# EAGLE schematic ECUTeen3.5_rev.A_20180306 (EAGLE 7.5.0)
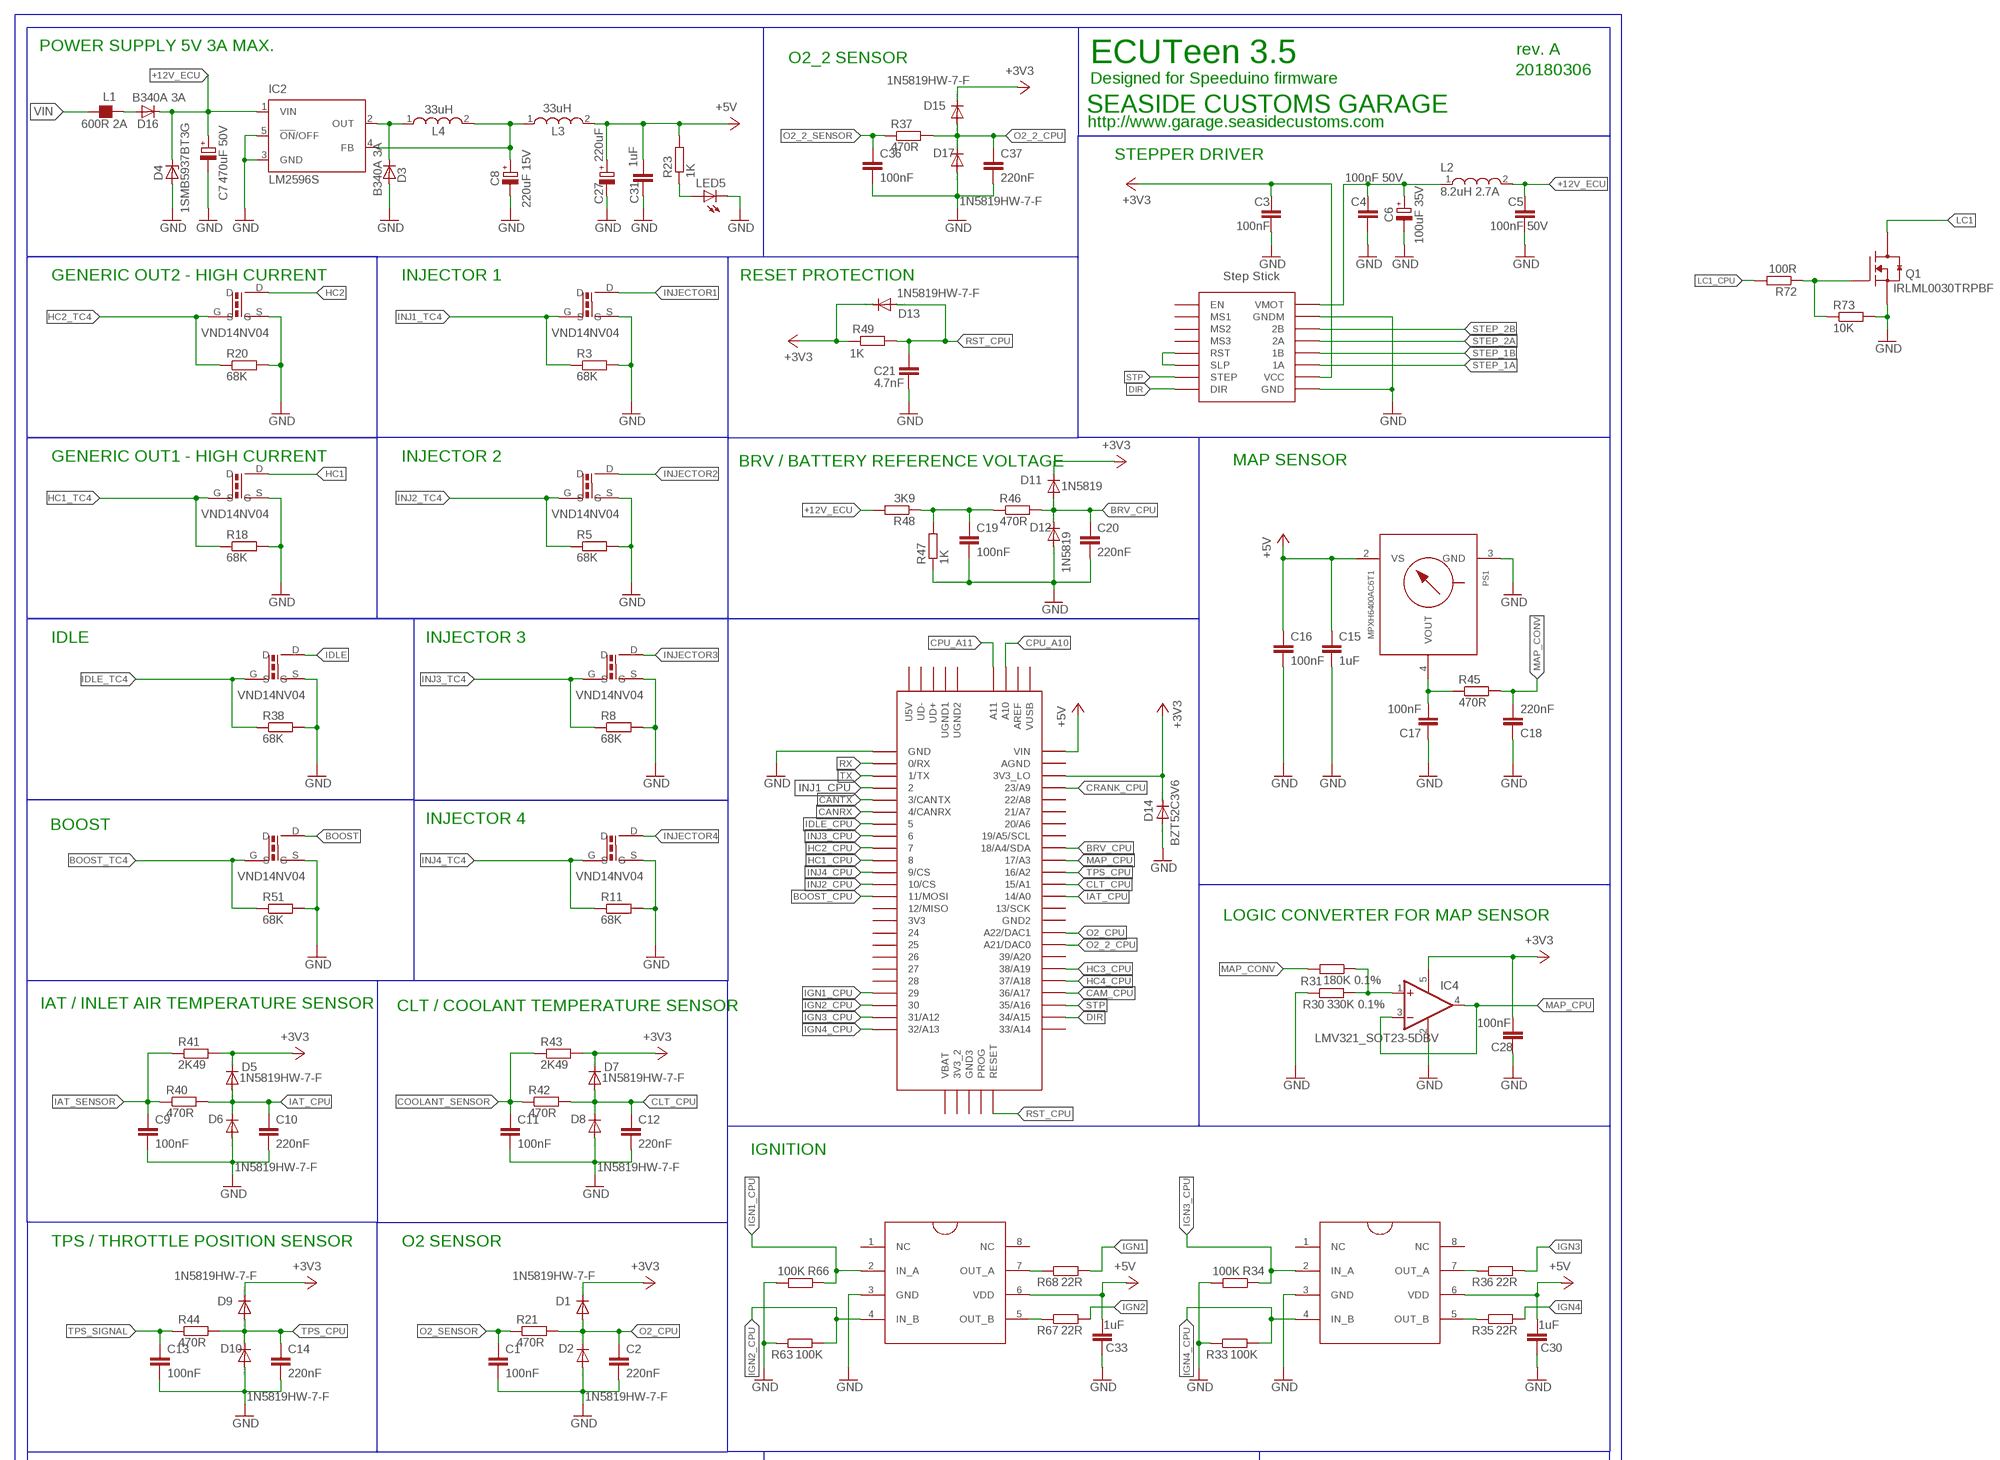
[diagram p0: schematic, sheet 1, part 1 of 2]
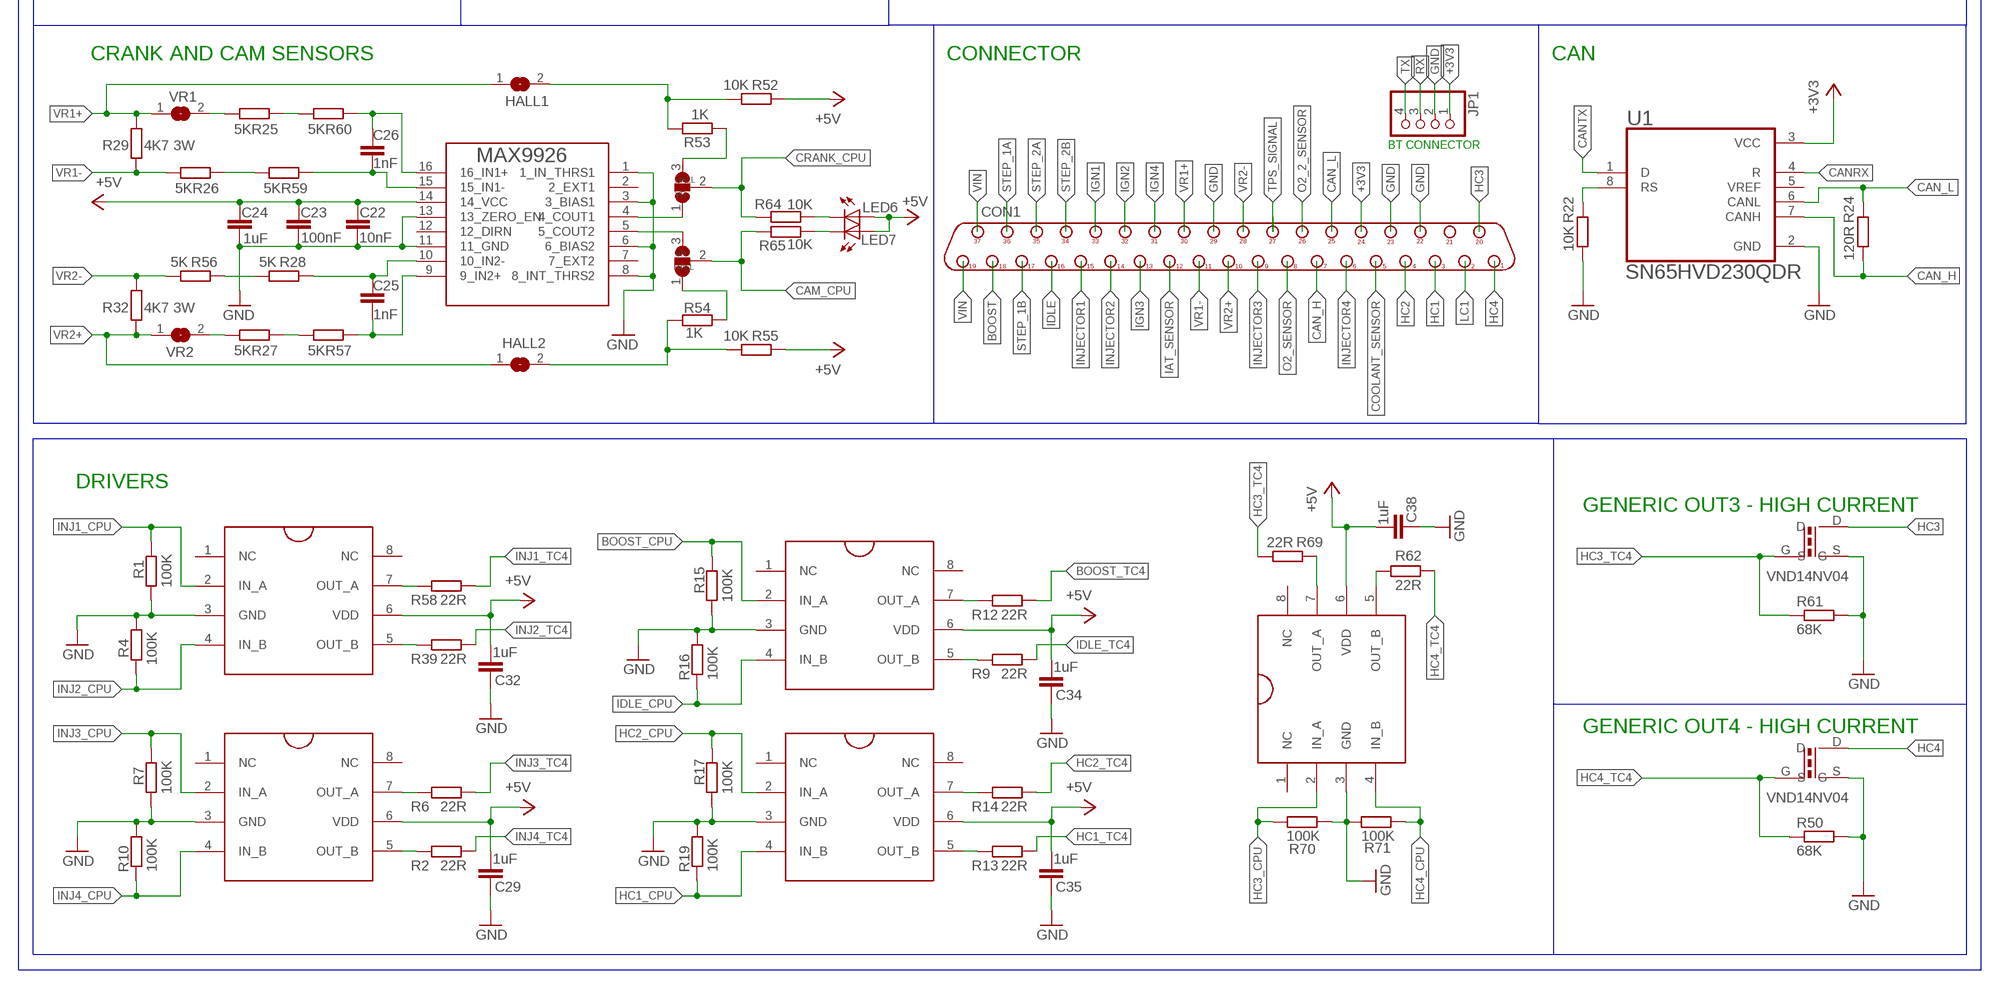
[diagram p1: schematic, sheet 1, part 2 of 2]

## Parts
C1  100nF  C-EUC0805  [C0805]
C2  220nF  C-EUC0805  [C0805]
C3  100nF  C-EUC0805  [C0805]
C4  100nF 50V  C-EUC0805  [C0805]
C5  100nF 50V  C-EUC0805  [C0805]
C6  100uF 35V  CPOL-EUD  [PANASONIC_D]
C7  470uF 50V  CPOL-EUD  [PANASONIC_D]
C8  220uF 15V  CPOL-EUD  [PANASONIC_D]
C9  100nF  C-EUC0805  [C0805]
C10  220nF  C-EUC0805  [C0805]
C11  100nF  C-EUC0805  [C0805]
C12  220nF  C-EUC0805  [C0805]
C13  100nF  C-EUC0805  [C0805]
C14  220nF  C-EUC0805  [C0805]
C15  1uF  C-EUC0805  [C0805]
C16  100nF  C-EUC0805  [C0805]
C17  100nF  C-EUC0805  [C0805]
C18  220nF  C-EUC0805  [C0805]
C19  100nF  C-EUC0805  [C0805]
C20  220nF  C-EUC0805  [C0805]
C21  4.7nF  C-EUC0805  [C0805]
C22  10nF  C-EUC0805  [C0805]
C23  100nF  C-EUC0805  [C0805]
C24  1uF  C-EUC0805  [C0805]
C25  1nF  C-EUC0805  [C0805]
C26  1nF  C-EUC0805  [C0805]
C27  220uF  CPOL-EUD  [PANASONIC_D]
C28  100nF  C-EUC0805  [C0805]
C29  1uF  C-EUC0805  [C0805]
C30  1uF  C-EUC0805  [C0805]
C31  1uF  C-EUC0805  [C0805]
C32  1uF  C-EUC0805  [C0805]
C33  1uF  C-EUC0805  [C0805]
C34  1uF  C-EUC0805  [C0805]
C35  1uF  C-EUC0805  [C0805]
C36  100nF  C-EUC0805  [C0805]
C37  220nF  C-EUC0805  [C0805]
C38  1uF  C-EUC0805  [C0805]
CON1  DB37M/90  [D-37M/90]
D1  1N5819HW-7-F  DIODE-SOD123  [SOD123]
D2  1N5819HW-7-F  DIODE-SOD123  [SOD123]
D3  B340A 3A  S1A  [DO214AC]
D4  1SMB5937BT3G  ZENER-DIODESMB  [SMB]
D5  1N5819HW-7-F  DIODE-SOD123  [SOD123]
D6  1N5819HW-7-F  DIODE-SOD123  [SOD123]
D7  1N5819HW-7-F  DIODE-SOD123  [SOD123]
D8  1N5819HW-7-F  DIODE-SOD123  [SOD123]
D9  1N5819HW-7-F  DIODE-SOD123  [SOD123]
D10  1N5819HW-7-F  DIODE-SOD123  [SOD123]
D11  1N5819  DIODE-SOD123  [SOD123]
D12  1N5819  DIODE-SOD123  [SOD123]
D13  1N5819HW-7-F  DIODE-SOD123  [SOD123]
D14  BZT52C3V6  DIODE-SOD123  [SOD123]
D15  1N5819HW-7-F  DIODE-SOD123  [SOD123]
D16  B340A 3A  S1A  [DO214AC]
D17  1N5819HW-7-F  DIODE-SOD123  [SOD123]
IC2  LM2596S  [TO263-5]
IC4  LMV321_SOT23-5DBV  [SOT23-5]
JMP1  SJ2W  [SJ_2]
JMP2  SJ2W  [SJ_2]
JP1  PINHD-1X4  [1X04]
L1  600R 2A  FB_1206  [L1206]
L2  8.2uH 2.7A  WE-PD_7332/7345_PLASTIC_BASE  [WE-PD_7332/7345_PLASTIC_BASE]
L3  33uH  WE-LHMI_7030/7050  [WE-LHMI_7030/7050]
L4  33uH  WE-LHMI_7030/7050  [WE-LHMI_7030/7050]
LED5  LEDCHIP-LED0805  [CHIP-LED0805]
LED6  LEDCHIP-LED0805  [CHIP-LED0805]
LED7  LEDCHIP-LED0805  [CHIP-LED0805]
PS1  MPXH6400AC6T1  [1317A]
Q1  IRLML0030TRPBF  MOSFET-NCH_SOT-23  [SOT95P280X135-3N]
R1  100K  R-EU_R0805  [R0805]
R2  22R  R-EU_R0805  [R0805]
R3  68K  R-EU_R0805  [R0805]
R4  100K  R-EU_R0805  [R0805]
R5  68K  R-EU_R0805  [R0805]
R6  22R  R-EU_R0805  [R0805]
R7  100K  R-EU_R0805  [R0805]
R8  68K  R-EU_R0805  [R0805]
R9  22R  R-EU_R0805  [R0805]
R10  100K  R-EU_R0805  [R0805]
R11  68K  R-EU_R0805  [R0805]
R12  22R  R-EU_R0805  [R0805]
R13  22R  R-EU_R0805  [R0805]
R14  22R  R-EU_R0805  [R0805]
R15  100K  R-EU_R0805  [R0805]
R16  100K  R-EU_R0805  [R0805]
R17  100K  R-EU_R0805  [R0805]
R18  68K  R-EU_R0805  [R0805]
R19  100K  R-EU_R0805  [R0805]
R20  68K  R-EU_R0805  [R0805]
R21  470R  R-EU_R0805  [R0805]
R22  10K  R-EU_R0805  [R0805]
R23  1K  R-EU_R0805  [R0805]
R24  120R  R-EU_R0805  [R0805]
R25  5K  R-EU_R0805  [R0805]
R26  5K  R-EU_R0805  [R0805]
R27  5K  R-EU_R0805  [R0805]
R28  5K  R-EU_R0805  [R0805]
R29  4K7 3W  R-EU_R2512  [R2512]
R30  330K 0.1%  R-EU_R0805  [R0805]
R31  180K 0.1%  R-EU_R0805  [R0805]
R32  4K7 3W  R-EU_R2512  [R2512]
R33  100K  R-EU_R0805  [R0805]
R34  100K  R-EU_R0805  [R0805]
R35  22R  R-EU_M1206  [M1206]
R36  22R  R-EU_M1206  [M1206]
R37  470R  R-EU_R0805  [R0805]
R38  68K  R-EU_R0805  [R0805]
R39  22R  R-EU_R0805  [R0805]
R40  470R  R-EU_R0805  [R0805]
R41  2K49  R-EU_R0805  [R0805]
R42  470R  R-EU_R0805  [R0805]
R43  2K49  R-EU_R0805  [R0805]
R44  470R  R-EU_R0805  [R0805]
R45  470R  R-EU_R0805  [R0805]
R46  470R  R-EU_R0805  [R0805]
R47  1K  R-EU_R0805  [R0805]
R48  3K9  R-EU_R0805  [R0805]
R49  1K  R-EU_R0805  [R0805]
R50  68K  R-EU_R0805  [R0805]
R51  68K  R-EU_R0805  [R0805]
R52  10K  R-EU_R0805  [R0805]
R53  1K  R-EU_R0805  [R0805]
R54  1K  R-EU_R0805  [R0805]
R55  10K  R-EU_R0805  [R0805]
R56  5K  R-EU_R0805  [R0805]
R57  5K  R-EU_R0805  [R0805]
R58  22R  R-EU_R0805  [R0805]
R59  5K  R-EU_R0805  [R0805]
R60  5K  R-EU_R0805  [R0805]
R61  68K  R-EU_R0805  [R0805]
R62  22R  R-EU_R0805  [R0805]
R63  100K  R-EU_R0805  [R0805]
R64  10K  R-EU_R0805  [R0805]
R65  10K  R-EU_R0805  [R0805]
R66  100K  R-EU_R0805  [R0805]
R67  22R  R-EU_M1206  [M1206]
R68  22R  R-EU_M1206  [M1206]
R69  22R  R-EU_R0805  [R0805]
R70  100K  R-EU_R0805  [R0805]
R71  100K  R-EU_R0805  [R0805]
R72  100R  R-EU_R0805  [R0805]
R73  10K  R-EU_R0805  [R0805]
SJ3  VR2  SJ  [SJ]
SJ4  VR1  SJ  [SJ]
SJ5  HALL2  SJ  [SJ]
SJ6  HALL1  SJ  [SJ]
STEPSTICK-X  STEP-STICK  [STEP-STICK]
U1  SN65HVD230QDR  [SOIC127P600X175-8N]
U$1  TEENSY_3.5/3.6  [TEENSY_3.5/3.6]
U$2  DPAK_N-CHANNEL_MOSFET  [DPAK_N-CHANNEL_MOSFET]
U$3  DPAK_N-CHANNEL_MOSFET  [DPAK_N-CHANNEL_MOSFET]
U$4  DPAK_N-CHANNEL_MOSFET  [DPAK_N-CHANNEL_MOSFET]
U$5  DPAK_N-CHANNEL_MOSFET  [DPAK_N-CHANNEL_MOSFET]
U$6  DPAK_N-CHANNEL_MOSFET  [DPAK_N-CHANNEL_MOSFET]
U$7  TC427SO-8  [SO-8]
U$8  DPAK_N-CHANNEL_MOSFET  [DPAK_N-CHANNEL_MOSFET]
U$9  TC427SO-8  [SO-8]
U$10  MAX9926  [QSOP16]
U$11  TC427SO-8  [SO-8]
U$12  DPAK_N-CHANNEL_MOSFET  [DPAK_N-CHANNEL_MOSFET]
U$13  DPAK_N-CHANNEL_MOSFET  [DPAK_N-CHANNEL_MOSFET]
U$14  TC427SO-8  [SO-8]
U$15  TC427SO-8  [SO-8]
U$16  TC427SO-8  [SO-8]
U$17  DPAK_N-CHANNEL_MOSFET  [DPAK_N-CHANNEL_MOSFET]
U$18  DPAK_N-CHANNEL_MOSFET  [DPAK_N-CHANNEL_MOSFET]
U$19  TC427SO-8  [SO-8]

## Nets
+3V3: C3.1 C28.2 CON1.24 D1.C D5.C D7.C D9.C D11.C D13.C D14.C D15.C IC4.5(V+) JP1.1 R41.2 R43.2 R49.1 STEPSTICK-X.VCC U1.3(VCC) U$1.3V3_LO
+5V: C15.1 C16.1 C22.1 C23.1 C24.1 C27.+ C29.2 C30.2 C31.1 C32.2 C33.2 C34.2 C35.2 C38.2 L3.2 LED6.A LED7.A PS1.2(VS) R23.2 R52.1 R55.1 U$1.VIN U$7.6(VDD) U$9.6(VDD) U$10.14(14_VCC) U$11.6(VDD) U$14.6(VDD) U$15.6(VDD) U$16.6(VDD) U$19.6(VDD)
+12V_ECU: C5.1 C7.+ D4.C D16.C IC2.1(VIN) L2.2 R48.2
BOOST: CON1.18 U$13.D
BOOST_CPU: R15.2 U$1.11/MOSI U$15.2(IN_A)
BOOST_TC4: R12.2 R51.1 U$13.G
BRV_CPU: C20.1 D11.A D12.C R46.2 U$1.18/A4/SDA
CAM_CPU: JMP2.2 R65.1 U$1.36/A17
CAN_H: CON1.7 R24.2 U1.7(CANH)
CAN_L: CON1.25 R24.1 U1.6(CANL)
CANRX: U1.4(R) U$1.4/CANRX
CANTX: U1.1(D) U$1.3/CANTX
CLT_CPU: C12.1 D7.A D8.C R42.2 U$1.15/A1
COOLANT_SENSOR: C11.1 CON1.5 R42.1 R43.1
CPU_A10: U$1.A10
CPU_A11: U$1.A11
CRANK_CPU: JMP1.2 R64.1 U$1.23/A9
DIR: STEPSTICK-X.DIR U$1.34/A15
GND: C1.2 C2.2 C3.2 C4.2 C5.2 C6.- C7.- C8.- C9.2 C10.2 C11.2 C12.2 C13.2 C14.2 C15.2 C16.2 C17.1 C18.1 C19.2 C20.2 C21.2 C22.2 C23.2 C24.2 C27.- C28.1 C29.1 C30.1 C31.2 C32.1 C33.1 C34.1 C35.1 C36.2 C37.2 C38.1 CON1.22 CON1.23 CON1.29 D2.A D3.A D4.A D6.A D8.A D10.A D12.A D14.A D17.A IC2.3(GND) IC2.5(!ON!/OFF) IC4.2(V-) JP1.2 LED5.C PS1.3(GND) Q1.2(S) R1.1 R3.2 R4.1 R5.2 R7.1 R8.2 R10.1 R11.2 R15.1 R16.1 R17.1 R18.2 R19.1 R20.2 R22.2 R30.1 R33.1 R34.2 R38.2 R47.1 R50.2 R51.2 R61.2 R63.1 R66.2 R70.1 R71.1 R73.2 STEPSTICK-X.GND STEPSTICK-X.GNDM U1.2(GND) U$1.GND U$2.S U$3.S U$4.S U$5.S U$6.S U$7.3(GND) U$8.S U$9.3(GND) U$10.1(1_IN_THRS1) U$10.3(3_BIAS1) U$10.6(6_BIAS2) U$10.8(8_INT_THRS2) U$10.11(11_GND) U$10.13(13_ZERO_EN) U$11.3(GND) U$12.S U$13.S U$14.3(GND) U$15.3(GND) U$16.3(GND) U$17.S U$18.S U$19.3(GND)
HC1: CON1.3 U$3.D
HC1_CPU: R19.2 U$1.8 U$16.4(IN_B)
HC1_TC4: R13.2 R18.1 U$3.G
HC2: CON1.4 U$2.D
HC2_CPU: R17.2 U$1.7 U$16.2(IN_A)
HC2_TC4: R14.2 R20.1 U$2.G
HC3: CON1.20 U$17.D
HC3_CPU: R70.2 U$1.38/A19 U$19.2(IN_A)
HC3_TC4: R61.1 R69.2 U$17.G
HC4: CON1.1 U$18.D
HC4_CPU: R71.2 U$1.37/A18 U$19.4(IN_B)
HC4_TC4: R50.1 R62.2 U$18.G
IAT_CPU: C10.1 D5.A D6.C R40.2 U$1.14/A0
IAT_SENSOR: C9.1 CON1.12 R40.1 R41.1
IDLE: CON1.16 U$5.D
IDLE_CPU: R16.2 U$1.5 U$15.4(IN_B)
IDLE_TC4: R9.2 R38.1 U$5.G
IGN1: CON1.33 R68.2
IGN1_CPU: R66.1 U$1.29 U$9.2(IN_A)
IGN2: CON1.32 R67.2
IGN2_CPU: R63.2 U$1.30 U$9.4(IN_B)
IGN3: CON1.13 R36.2
IGN3_CPU: R34.1 U$1.31/A12 U$11.2(IN_A)
IGN4: CON1.31 R35.2
IGN4_CPU: R33.2 U$1.32/A13 U$11.4(IN_B)
INJ1_CPU: R1.2 U$1.2 U$14.2(IN_A)
INJ1_TC4: R3.1 R58.2 U$12.G
INJ2_CPU: R4.2 U$1.10/CS U$14.4(IN_B)
INJ2_TC4: R5.1 R39.2 U$4.G
INJ3_CPU: R7.2 U$1.6 U$7.2(IN_A)
INJ3_TC4: R6.2 R8.1 U$6.G
INJ4_CPU: R10.2 U$1.9/CS U$7.4(IN_B)
INJ4_TC4: R2.2 R11.1 U$8.G
INJECTOR1: CON1.15 U$12.D
INJECTOR2: CON1.14 U$4.D
INJECTOR3: CON1.9 U$6.D
INJECTOR4: CON1.6 U$8.D
LC1: CON1.2 Q1.3(D)
LC1_CPU: R72.2
MAP_CONV: C18.2 R31.2 R45.2
MAP_CPU: IC4.3(-IN) IC4.4(OUT) U$1.17/A3
N$1: JMP1.1 U$10.4(4_COUT1)
N$2: JMP1.3 R53.2
N$3: R67.1 U$9.5(OUT_B)
N$4: JMP2.3 U$10.5(5_COUT2)
N$5: R68.1 U$9.7(OUT_A)
N$6: R35.1 U$11.5(OUT_B)
N$7: JMP2.1 R54.1
N$8: R36.1 U$11.7(OUT_A)
N$9: R62.1 U$19.5(OUT_B)
N$10: R2.1 U$7.5(OUT_B)
N$11: R69.1 U$19.7(OUT_A)
N$12: R22.1 U1.8(RS)
N$14: STEPSTICK-X.RST STEPSTICK-X.SLP
N$19: C4.1 C6.+ L2.1 STEPSTICK-X.VMOT
N$25: IC4.1(+IN) R30.2 R31.1
N$27: C19.1 R46.1 R47.2 R48.1
N$28: R54.2 R55.2 SJ5.2
N$32: C17.2 PS1.4(VOUT) R45.1
N$34: R52.2 R53.1 SJ6.2
N$35: C25.2 R57.1 U$10.9(9_IN2+)
N$36: C26.1 R60.1 U$10.16(16_IN1+)
N$37: C26.2 R59.1 U$10.15(15_IN1-)
N$38: C25.1 R28.1 U$10.10(10_IN2-)
N$41: R25.1 R60.2
N$42: R27.2 SJ3.2
N$48: R25.2 SJ4.2
N$49: LED7.C R65.2
N$50: LED6.C R64.2
N$51: D16.A L1.1
N$52: R6.1 U$7.7(OUT_A)
N$53: R9.1 U$15.5(OUT_B)
N$54: LED5.A R23.1
N$55: R26.1 R59.2
N$56: R27.1 R57.2
N$57: R28.2 R56.1
N$60: R12.1 U$15.7(OUT_A)
N$61: R13.1 U$16.5(OUT_B)
N$62: R39.1 U$14.5(OUT_B)
N$63: R14.1 U$16.7(OUT_A)
N$64: R58.1 U$14.7(OUT_A)
N$91: Q1.1(G) R72.1 R73.1
N$130: D3.C IC2.2(OUT) L4.1
O2_2_CPU: C37.1 D15.A D17.C R37.2 U$1.21/DAC0(A21/DAC0)
O2_2_SENSOR: C36.1 CON1.26 R37.1
O2_CPU: C2.1 D1.A D2.C R21.2 U$1.A22/DAC1
O2_SENSOR: C1.1 CON1.8 R21.1
RST_CPU: C21.1 D13.A R49.2 U$1.RESET
RX: JP1.3 U$1.0/RX
STEP_1A: CON1.36 STEPSTICK-X.1A
STEP_1B: CON1.17 STEPSTICK-X.1B
STEP_2A: CON1.35 STEPSTICK-X.2A
STEP_2B: CON1.34 STEPSTICK-X.2B
STP: STEPSTICK-X.SPT(STEP) U$1.35/A16
SUPP1: C8.+ IC2.4(FB) L3.1 L4.2
TPS_CPU: C14.1 D9.A D10.C R44.2 U$1.16/A2
TPS_SIGNAL: C13.1 CON1.27 R44.1
TX: JP1.4 U$1.1/TX
VIN: CON1.19 CON1.37 L1.2
VR1+: CON1.30 R29.1 SJ4.1 SJ6.1
VR1-: CON1.11 R26.2 R29.2
VR2+: CON1.10 R32.2 SJ3.1 SJ5.1
VR2-: CON1.28 R32.1 R56.2
Unconnected: CON1.21 PS1.1(NC) PS1.5(NC) PS1.6(NC) STEPSTICK-X.EN STEPSTICK-X.MS1 STEPSTICK-X.MS2 STEPSTICK-X.MS3 U1.5(VREF) U$1.3V3 U$1.3V3_2 U$1.12/MISO U$1.13/SCK U$1.19/A5/SCL U$1.20/A6 U$1.21/A7 U$1.22/A8 U$1.24 U$1.25 U$1.26 U$1.27 U$1.28 U$1.33/A14 U$1.39/A20 U$1.AGND U$1.AREF U$1.GND2 U$1.GND3 U$1.PROG U$1.U5V U$1.UD+ U$1.UD- U$1.UGND1 U$1.UGND2 U$1.VBAT U$1.VUSB U$7.1(NC) U$7.8(NC) U$9.1(NC) U$9.8(NC) U$10.2(2_EXT1) U$10.7(7_EXT2) U$10.12(12_DIRN) U$11.1(NC) U$11.8(NC) U$14.1(NC) U$14.8(NC) U$15.1(NC) U$15.8(NC) U$16.1(NC) U$16.8(NC) U$19.1(NC) U$19.8(NC)

## Buses
B$1
B$2
B$3

## Notes on the sheet
- POWER SUPPLY 5V 3A MAX. | rev. A
- O2_2 SENSOR | ECUTeen 3.5
- 20180306
- Designed for Speeduino firmware
- SEASIDE CUSTOMS GARAGE
- http://www.garage.seasidecustoms.com
- STEPPER DRIVER
- GENERIC OUT2 - HIGH CURRENT | INJECTOR 1 | RESET PROTECTION
- GENERIC OUT1 - HIGH CURRENT | INJECTOR 2 | MAP SENSOR
- BRV / BATTERY REFERENCE VOLTAGE
- IDLE | INJECTOR 3
- INJECTOR 4
- BOOST
- LOGIC CONVERTER FOR MAP SENSOR
- IAT / INLET AIR TEMPERATURE SENSOR | CLT / COOLANT TEMPERATURE SENSOR
- IGNITION
- TPS / THROTTLE POSITION SENSOR | O2 SENSOR
- CRANK AND CAM SENSORS | CONNECTOR | CAN
- BT CONNECTOR
- HALL
- VR
- VR
- HALL
- DRIVERS
- GENERIC OUT3 - HIGH CURRENT
- GENERIC OUT4 - HIGH CURRENT

## Library data of the parts
C1-C5 C9-C26 C28-C38 = resistor:C-EU: CAPACITOR, European symbol
C6-C8 C27 = resistor:CPOL-EU: POLARIZED CAPACITOR, European symbol
CON1 = DBF gniazda:DB37M/90
D1 D2 D5-D13 D15 D17 = diode:DIODE-: DIODE
D3 D16 = DO-214AC:S1*: S1A - S1M General Purpose Rectifiers Source: http://www.fairchildsemi.com/datasheets/S1/S1A.pdf; MF: Fairchild; MPN: S1A; OC_FARNELL: 9843868; OC_NEWARK: 58K9551
D4 = diode:ZENER-DIODE: Z-Diode
D14 = 1N5247B:DIODE-: DIODE
IC2 = national-semiconductor:LM2596: SIMPLE SWITCHER® Power Converter 150 kHz 3A Step-Down Voltage Regulator Source: http://www.national.com/ds/LM/LM2596.pdf; MF: NATIONAL SEMICONDUCTOR; MPN: LM2596S-ADJ/NOPB; OC_FARNELL: 9494367; OC_NEWARK: 41K3842
IC4 = LMV321 SOT23-5:LMV321_SOT23-5: LMV321 SOT23-5
JMP1 JMP2 = jumper:SJ2W: SMD solder JUMPER
JP1 = pinhead:PINHD-1X4: PIN HEADER
L1 = rc-master-smd:FB_: FERRITE BEAD
L2 = Wurth Passive:WE-PD: SMD Shielded Power Inductor Characteristics Magnetically shielded version which results in a low leakage field High Saturation currents up to 25 A Very low self-losses at high switching frequency‘s Wide inductances spectrum available at all sizes Operating temperature: –40 °C to +125 °C Applications Perfectly suitable for switching regulators with extremely high efficiency Integrated DC/DC- converter Switching regulators with low operating voltages (Graphic cards, embedded PC-Cards, Mainboards) Plastic base: Because of the one piece construction these are more suitable for high vibration or shock applications <http://katalog.we-online.de/media/images/eisos/FePBF_pf2.jpg> Details see: http://katalog.we-online.de/en/pbs/WE-PD? Updated by Dan Xu 2014-07-08 2014 (C) Wurth Elektronik
L3 L4 = Wurth Passive:WE-LHMI: SMD Low Profile High Current Molded Inductor Characteristics Compact design Magnetically shielded High current capability Handles high transient current spikes No acoustic noise and no leakage field Frequency range up to 5 MHz Operating temperature: –40 °C to +125 °C Applications DC/DC converters for high current power supplies DC/DC converters for Field Programmable Gate Array (FPGA) POL converters Portable power like PDA, digital cameras Mainboards/graphic cards Battery powered devices <http://katalog.we-online.de/media/images/eisos/IndLHMI_pf2.jpg> Details see: http://katalog.we-online.de/en/pbs/WE-LHMI? Updated by Dan Xu 2014-07-08 2014 (C) Wurth Elektronik
LED5-LED7 = led:LED: LED OSRAM: - CHIPLED LG R971, LG N971, LY N971, LG Q971, LY Q971, LO R971, LY R971 LH N974, LH R974 LS Q976, LO Q976, LY Q976 LO Q996 - Hyper CHIPLED LW Q18S LB Q993, LB Q99A, LB R99A - SideLED LS A670, LO A670, LY A670, LG A670, LP A670 LB A673, LV A673, LT A673, LW A673 LH A674 LY A675 LS A676, LA A676, LO A676, LY A676, LW A676 LS A679, LY A679, LG A679 - Hyper Micro SIDELED® LS Y876, LA Y876, LO Y876, LY Y876 LT Y87S - SmartLED LW L88C, LW L88S LB L89C, LB L89S, LG L890 LS L89K, LO L89K, LY L89K LS L896, LA L896, LO L896, LY L896 - TOPLED LS T670, LO T670, LY T670, LG T670, LP T670 LSG T670, LSP T670, LSY T670, LOP T670, LYG T670 LG T671, LOG T671, LSG T671 LB T673, LV T673, LT T673, LW T673 LH T674 LS T676, LA T676, LO T676, LY T676, LB T676, LH T676, LSB T676, LW T676 LB T67C, LV T67C, LT T67C, LS T67K, LO T67K, LY T67K, LW E67C LS E67B, LA E67B, LO E67B, LY E67B, LB E67C, LV E67C, LT E67C LW T67C LS T679, LY T679, LG T679 LS T770, LO T770, LY T770, LG T770, LP T770 LB T773, LV T773, LT T773, LW T773 LH T774 LS E675, LA E675, LY E675, LS T675 LS T776, LA T776, LO T776, LY T776, LB T776 LHGB T686 LT T68C, LB T68C - Hyper Mini TOPLED® LB M676 - Mini TOPLED Santana® LG M470 LS M47K, LO M47K, LY M47K Source: http://www.osram.convergy.de LUXEON: - LUMILED® LXK2-PW12-R00, LXK2-PW12-S00, LXK2-PW14-U00, LXK2-PW14-V00 LXK2-PM12-R00, LXK2-PM12-S00, LXK2-PM14-U00 LXK2-PE12-Q00, LXK2-PE12-R00, LXK2-PE12-S00, LXK2-PE14-T00, LXK2-PE14-U00 LXK2-PB12-K00, LXK2-PB12-L00, LXK2-PB12-M00, LXK2-PB14-N00, LXK2-PB14-P00, LXK2-PB14-Q00 LXK2-PR12-L00, LXK2-PR12-M00, LXK2-PR14-Q00, LXK2-PR14-R00 LXK2-PD12-Q00, LXK2-PD12-R00, LXK2-PD12-S00 LXK2-PH12-R00, LXK2-PH12-S00 LXK2-PL12-P00, LXK2-PL12-Q00, LXK2-PL12-R00 Source: www.luxeon.com KINGBRIGHT: KA-3528ASYC Source: www.kingbright.com
PS1 = mpx-freescale:MPXH6400A: High Temperature Accuracy Integrated Silicon Pressure Sensor for Measuring Absolute Pressure, On-Chip Signal Conditioned, Temperature Compensated and Calibrated INTEGRATED PRESSURE SENSOR 20 TO 400 kPA (3.0 TO 58 psi) 0.2 TO 4.8 V OUTPUT (3.0 TO 58 psi)
Q1 = ipc-7351-transistor:MOSFET-NCH_
R1-R73 = resistor:R-EU_: RESISTOR, European symbol
SJ3-SJ6 = jumper:SJ: SMD solder JUMPER
STEPSTICK-X = Arduino library Stepstick:STEP-STICK
U1 = SN65HVD230QDR:SN65HVD230QDR: Automotive Catalog 3.3-V CAN Transceivers 8-SOIC -40 to 125; AVAILABILITY: Good; DESCRIPTION: Automotive Catalog 3.3-V CAN Transceivers 8-SOIC -40 to 125; MF: Texas Instruments; MP: SN65HVD230QDR; PACKAGE: SOIC-8 Texas Instruments; PRICE: 1.62 USD
U$1 = Teensy356:TEENSY_3.5/3.6
U$2-U$6 U$8 U$12 U$13 U$17 U$18 = VND14NV04:DPAK_N-CHANNEL_MOSFET: VND14NV04
U$7 U$9 U$11 U$14-U$16 U$19 = TC426,427,428:TC427
U$10 = max9926:MAX9926